# Altium schematic sheet 线连接图纸.SchDoc
size A4
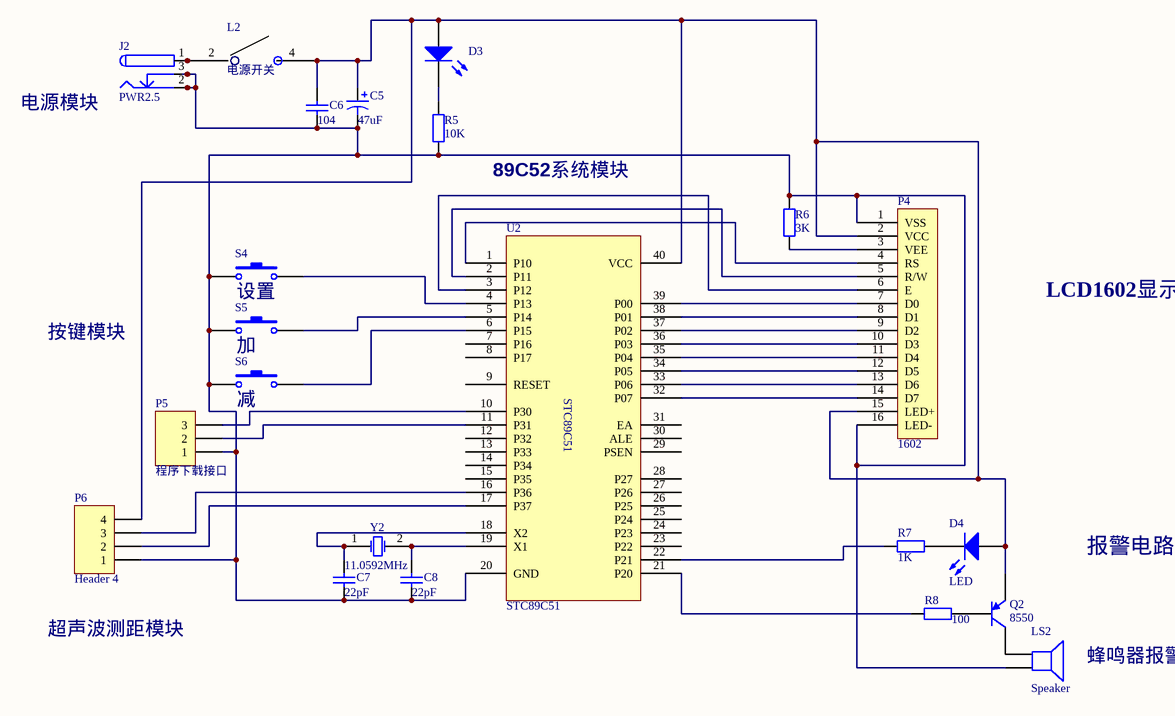
[diagram p0: 线连接图纸.SchDoc]

## Parts
C5  47uF  [CAP-100]
C6  104  [CAP]
C7  22pF  [CAP]
C8  22pF  [CAP]
D3  LED  [LED]  (value not drawn)
D4  LED  [LED]
J2  PWR2.5  [POWER]
L2  电源开关  [SWITCH]
LS2  Speaker  [SPEAK]
P4  1602  [lcd1602]
P5  程序下载接口  [HDR1X3]
P6  Header 4  [HDR1X4]
Q2  8550  [TO-92A]
R5  10K  [RES]
R6  3K  [RES]
R7  1K  [RES]
R8  100  [RES]
S4  (no value)  [KEY]
S5  (no value)  [KEY]
S6  (no value)  [KEY]
U2  STC89C51  [DIP40]
Y2  11.0592MHz  [XTAL200]

## Nets
NetC5_1: C5.1 C6.2 D3.1(A) D4.1(A) L2.4 P4.2(VCC) P4.15(LED+) P6.4 Q2.1(E) U2.40(VCC)
NetC5_2: C5.2 C6.1 C7.1 C8.1 J2.2 J2.2A J2.2B J2.3 J2.3A J2.3B LS2.2 P4.1(VSS) P4.16(LED-) P5.1 P6.1 R5.1 R6.2 S4.1 S5.1 S6.1 U2.20(GND)
NetC7_2: C7.2 U2.18(X2) Y2.1(OSC1)
NetC8_2: C8.2 U2.19(X1) Y2.2(OSC2)
NetD3_2: D3.2(K) R5.2
NetD4_2: D4.2(K) R7.2
NetJ2_1: J2.1 J2.1A J2.1B L2.2
NetLS2_1: LS2.1 Q2.3(C)
NetP4_3: P4.3(VEE) R6.1
NetP4_4: P4.4(RS) U2.1(P10)
NetP4_5: P4.5(R/W) U2.2(P11)
NetP4_6: P4.6(E) U2.3(P12)
NetP4_7: P4.7(D0) U2.39(P00)
NetP4_8: P4.8(D1) U2.38(P01)
NetP4_9: P4.9(D2) U2.37(P02)
NetP4_10: P4.10(D3) U2.36(P03)
NetP4_11: P4.11(D4) U2.35(P04)
NetP4_12: P4.12(D5) U2.34(P05)
NetP4_13: P4.13(D6) U2.33(P06)
NetP4_14: P4.14(D7) U2.32(P07)
NetP5_2: P5.2 U2.11(P31)
NetP5_3: P5.3 U2.10(P30)
NetP6_2: P6.2 U2.17(P37)
NetP6_3: P6.3 U2.16(P36)
NetQ2_2: Q2.2(B) R8.2
NetR7_1: R7.1 U2.22(P21)
NetR8_1: R8.1 U2.21(P20)
NetS4_2: S4.2 U2.4(P13)
NetS5_2: S5.2 U2.5(P14)
NetS6_2: S6.2 U2.6(P15)

Not connected (* = marked no-connect by the designer): U2 7(P16) 8(P17) 9(RESET) 12(P32) 13(P33) 14(P34) 15(P35) 23(P22) 24(P23) 25(P24) 26(P25) 27(P26) 28(P27) 29(PSEN) 30(ALE) 31(EA)

## Notes on the sheet
- 电源模块
- 89C52系统模块
- (near S4) 设置
- LCD1602显示
- 按键模块
- (near S5) 加
- (near S6) 减
- 报警电路
- 超声波测距模块
- 蜂鸣器报警

## Library data of the parts
C5 = Cap Pol1: Polarized Capacitor (Radial); Published: 8-Jun-2000; LatestRevisionDate: 17-Jul-2002; LatestRevisionNote: Re-released for DXP Platform.; PackageReference: RB7.6-15; Publisher: Altium Limited; Value: 47uF
C6-C8 = Cap: Capacitor; Published: 8-Jun-2000; LatestRevisionDate: 17-Jul-2002; LatestRevisionNote: Re-released for DXP Platform.; PackageReference: RAD-0.3; Publisher: Altium Limited
  C6: Value: 104
  C7 C8: Value: 22pF
D3 D4 = LED0: Typical INFRARED GaAs LED; Published: 8-Jun-2000; LatestRevisionDate: 08-Jul-2005; LatestRevisionNote: Mech Layer 1 removed.; PackageReference: LED-0; Publisher: Altium Limited
J2 = PWR2.5: Low Voltage Power Supply Connector; Published: 17-Dec-2003; DatasheetDocument: 09-May-2002; Publisher: Altium Limited; ComponentLink1Description: Manufacturer Link; ComponentLink1URL: http://domino.kycon.com/internet/Products.html
L2 = Liujiao
LS2 = Speaker: Loudspeaker; Published: 24-Mar-1999; LatestRevisionDate: 17-Jul-2002; LatestRevisionNote: Re-released for DXP Platform.; PackageReference: PIN2; Publisher: Altium Limited
P5 = Header 3: Header, 3-Pin; LatestRevisionDate: 17-Jul-2002; LatestRevisionNote: Re-released for DXP Platform.; Publisher: Altium Limited
P6 = Header 4: Header, 4-Pin; LatestRevisionDate: 17-Jul-2002; LatestRevisionNote: Re-released for DXP Platform.; Publisher: Altium Limited
Q2 = 2N3906: PNP General Purpose Amplifier; Published: 8-Jun-2000; LatestRevisionDate: 15-Jan-2003; LatestRevisionNote: PCB Footprint 'BCY-W3/D4.7' replaced; DatasheetDocument: 1997; PackageDocument: Sep-1998; PackageReference: TO-92A; Publisher: Altium Limited; Code_JEDEC: TO-92A; ComponentLink1Description: Manufacturer Link; ComponentLink1URL: http://www.fairchildsemi.com/; ComponentLink2Description: Datasheet; ComponentLink2URL: http://www.fairchildsemi.com/ds/2N%2F2N3906.pdf
R5-R8 = Res2: Resistor; Published: 8-Jun-2000; LatestRevisionDate: 17-Jul-2002; LatestRevisionNote: Re-released for DXP Platform.; PackageReference: AXIAL-0.4; Publisher: Altium Limited
  R5: Value: 10K
  R6: Value: 3K
  R7: Value: 1K
  R8: Value: 100
S4-S6 = SW-PB: Switch; Published: 24-Mar-1999; LatestRevisionDate: 17-Jul-2002; LatestRevisionNote: Re-released for DXP Platform.; PackageReference: SPST-2; Publisher: Altium Limited
U2 = STC89C52
Y2 = XTAL: Crystal Oscillator; Published: 8-Jun-2000; LatestRevisionDate: 17-Jul-2002; LatestRevisionNote: Re-released for DXP Platform.; PackageReference: R38; Publisher: Altium Limited